# Altium project 100863_project.prjpcb
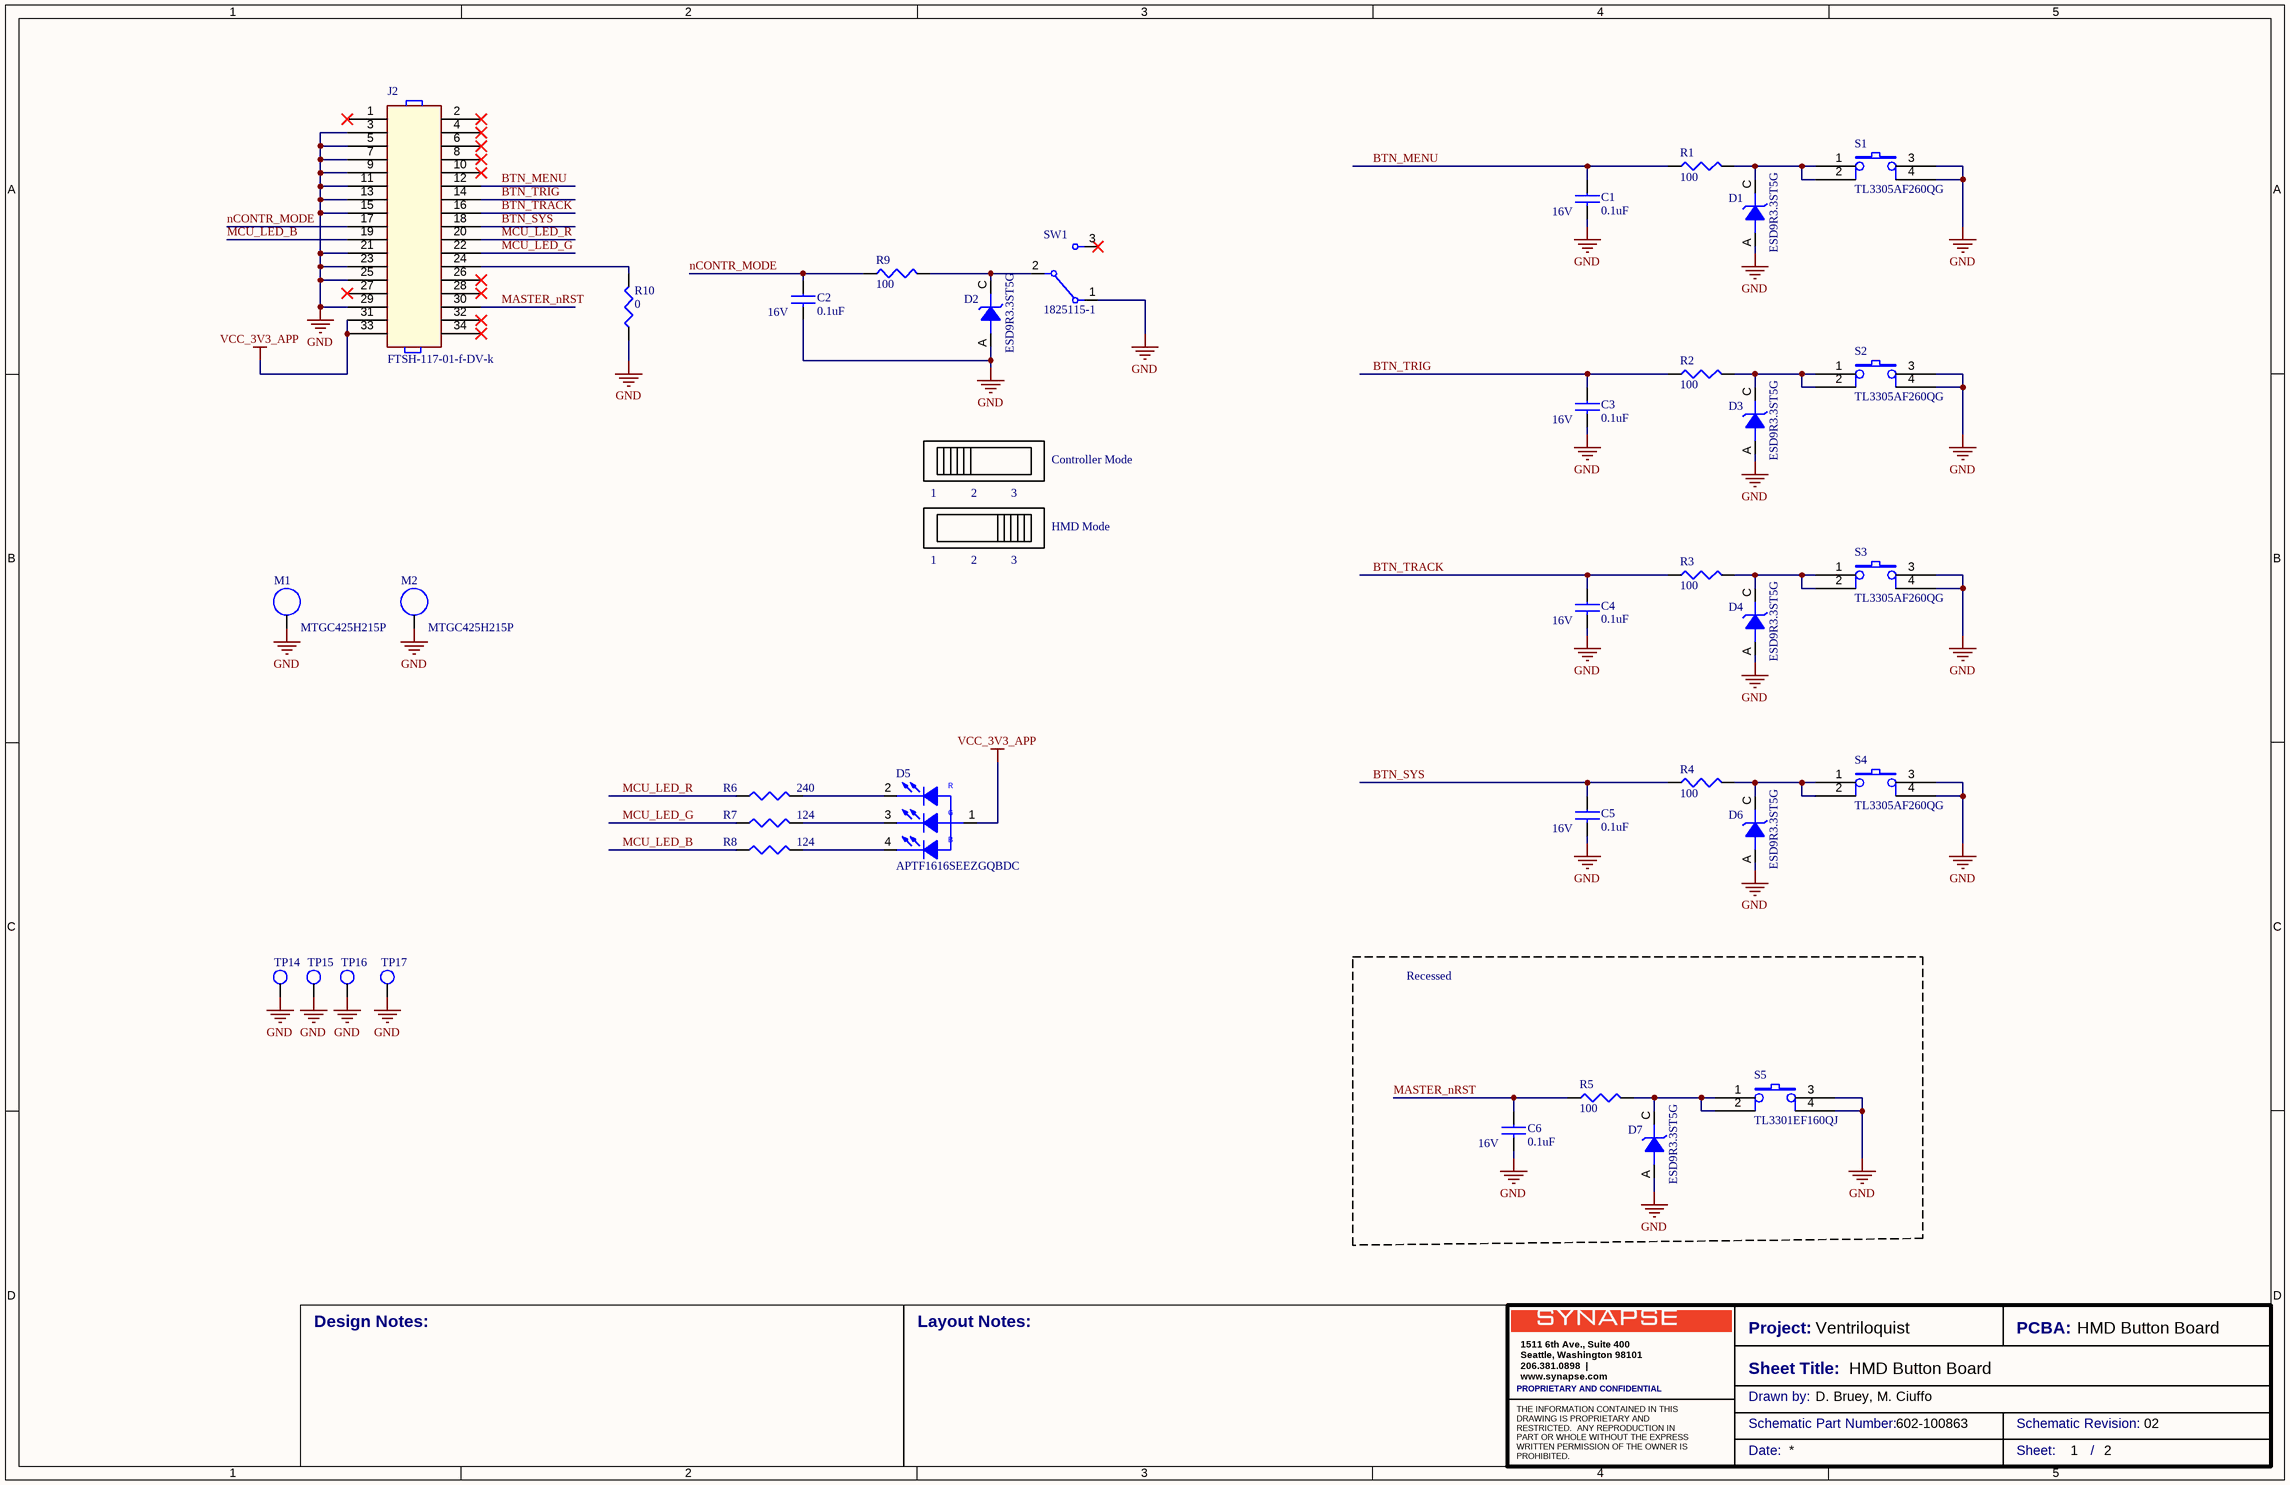
[diagram p0: HMD_Button.SchDoc]
Board_Name: HMD Button Board; Board_Number: 100863; PCB_Revision: 02; Project_Name: Ventriloquist; Sch_Revision: 02
2 sheets, 36 parts. Net scope: global (net labels, ports and power ports of the same name join across sheets).
Board file: 100863.PcbDoc
Sheets:
  HMD_Button.SchDoc
  Revision_Log.SchDoc

## Sheet HMD_Button.SchDoc: HMD Button Board
size 431 x 279 mm; DrawnBy: D. Bruey, M. Ciuffo; Organization: Synapse Product Development, LLC.; Address1: 1511 6th Ave., Suite 400; Address2: Seattle, Washington 98101; Address3: 206.381.0898; Address4: www.synapse.com; DocumentNumber: 1; SheetNumber: 1; SheetTotal: 2; PageSetup: Record=PageOptions|CenterHorizontal=True|CenterVertical=True|PrintScale=1.06|XCorrection=1.00|YCorrection=1.00|PrintKind=1|BorderSize=5000000|LeftOffset=0|BottomOffset=0|Orientation=2|PaperLength=4318|PaperWidth=2794|Scale=100|PaperSource=7|PrintQuality=200|MediaType=1|DitherType=10|PrintScaleMode=1|PaperKind=11x17|PaperIndex=3

### Parts
C1  0.1uF  Voltage: 16V  [0402-IPCsm_55]
C2  0.1uF  Voltage: 16V  [0402-IPCsm_55]
C3  0.1uF  Voltage: 16V  [0402-IPCsm_55]
C4  0.1uF  Voltage: 16V  [0402-IPCsm_55]
C5  0.1uF  Voltage: 16V  [0402-IPCsm_55]
C6  0.1uF  Voltage: 16V  [0402-IPCsm_55]
D1  ESD9R3.3ST5G  [sod923-40]
D2  ESD9R3.3ST5G  [sod923-40]
D3  ESD9R3.3ST5G  [sod923-40]
D4  ESD9R3.3ST5G  [sod923-40]
D5  APTF1616SEEZGQBDC  [led_RBG_1p6x1p6_sm]
D6  ESD9R3.3ST5G  [sod923-40]
D7  ESD9R3.3ST5G  [sod923-40]
J2  FTSH-117-01-f-DV-k  [FTSH-117-01-XXX-DV-K]
M1  MTGC425H215P  [MTGC425H215P]  (no BOM)
M2  MTGC425H215P  [MTGC425H215P]  (no BOM)
R1  100  [0402-IPCsm_40]
R2  100  [0402-IPCsm_40]
R3  100  [0402-IPCsm_40]
R4  100  [0402-IPCsm_40]
R5  100  [0402-IPCsm_40]
R6  240  [0402-IPCsm_40]
R7  124  [0402-IPCsm_40]
R8  124  [0402-IPCsm_40]
R9  100  [0402-IPCsm_40]
R10  0  [0402-IPCsm_40]
S1  TL3305AF260QG  [SW_TL3305_G]
S2  TL3305AF260QG  [SW_TL3305_G]
S3  TL3305AF260QG  [SW_TL3305_G]
S4  TL3305AF260QG  [SW_TL3305_G]
S5  TL3301EF160QJ  [SW_TL3301_J]
SW1  1825115-1  [SW_3_TE_1825115]
TP14  tp-1mm  [TP-S100_SMT]  (value not drawn)  (no BOM)
TP15  tp-1mm  [TP-S100_SMT]  (value not drawn)  (no BOM)
TP16  tp-1mm  [TP-S100_SMT]  (value not drawn)  (no BOM)
TP17  tp-1mm  [TP-S100_SMT]  (value not drawn)  (no BOM)

### Blocks framed on the sheet
Recessed: C6 D7 R5 S5

### Nets
GND: C1.2 C2.2 C3.2 C4.2 C5.2 C6.2 D1.A D2.A D3.A D4.A D6.A D7.A J2.3 J2.5 J2.7 J2.9 J2.11 J2.13 J2.15 J2.21 J2.23 J2.25 J2.29 M1.1 M2.1 R10.1 S1.3 S1.4 S2.3 S2.4 S3.3 S3.4 S4.3 S4.4 S5.3 S5.4 SW1.1 TP14.1(TP) TP15.1(TP) TP16.1(TP) TP17.1(TP)
VCC_3V3_APP: D5.1(ANODE) J2.31 J2.33
BTN_MENU: C1.1 J2.12 R1.1
BTN_SYS: C5.1 J2.18 R4.1
BTN_TRACK: C4.1 J2.16 R3.1
BTN_TRIG: C3.1 J2.14 R2.1
MASTER_nRST: C6.1 J2.30 R5.1
MCU_LED_B: J2.19 R8.1
MCU_LED_G: J2.22 R7.1
MCU_LED_R: J2.20 R6.1
nCONTR_MODE: C2.1 J2.17 R9.1
NetD1_C: D1.C R1.2 S1.1 S1.2
NetD2_C: D2.C R9.2 SW1.2
NetD3_C: D3.C R2.2 S2.1 S2.2
NetD4_C: D4.C R3.2 S3.1 S3.2
NetD5_2: D5.2(R) R6.2
NetD5_3: D5.3(G) R7.2
NetD5_4: D5.4(B) R8.2
NetD6_C: D6.C R4.2 S4.1 S4.2
NetD7_C: D7.C R5.2 S5.1 S5.2
NetJ2_24: J2.24 R10.2

Not connected (* = marked no-connect by the designer): J2 1* 2* 4* 6* 8* 10* 26* 27* 28* 32* 34*; SW1 3*

### Notes on the sheet
- 1
- 2
- 3
- Controller Mode
- HMD Mode
- Design Notes:
- Layout Notes:
- Project:
- Sheet Title:
- PCBA:
- PROPRIETARY AND CONFIDENTIAL
- Drawn by:
- Schematic Part Number:
- Schematic Revision:
- Date:
- Sheet:
- /

### Library data of the parts
C1-C6 = GRM155R71C104KA88D: CAP CER .1UF 16V X7R 0402; part_type: capacitor; id: 588; mfg: MURATA; dist: DIGIKEY; dist_pn: 490-3261-1-ND; source_package: C_0P1U_16V_X7R_0402; tolerance: 10%; TableName: viewAltiumCapacitors; mfg_pn: GRM155R71C104KA88D; type: X7R; height: 0.55MM; status: Unknown
D1-D4 D6 D7 = ESD9R3.3ST5G: TVS DIODE 3.3VWM 7.8VC SOD923; id: 1102; mfg: On Semiconductor; dist: Digikey; dist_pn: ESD9R3.3ST5GOSCT-ND; voltage: 3.3V; TableName: viewAltiumDiscretes; mfg_pn: ESD9R3.3ST5G; part_type: tvs; type: TVS; status: Unknown; height: 0.4mm
D5 = APTF1616SEEZGQBDC: LED RGB CLEAR 0606 SMD; id: 1228; mfg: Kingbright; dist: Digikey; dist_pn: 754-1500-2-ND; current: 25mA; TableName: viewAltiumDiscretes; mfg_pn: APTF1616SEEZGQBDC; part_type: LED; source_package: LED; height: .7mm; status: Unknown
J2 = FTSH-117-01-f-DV-k: 34 Positions Header, Shrouded Connector 0.050" (1.27mm) Surface Mount Gold; id: 1653; mfg: Samtec; dist: Digikey; dist_pn: SAM8912-ND; positions: 34; TableName: viewAltiumConnectors; mfg_pn: FTSH-117-01-F-DV-K; part_type: connector; height: 5.97mm; status: Unknown
M1 M2 = MTGC425H215P: MTG, 4.25mm PAD, 2.15mm Plated Hole; part_type: mounting; id: 1240; dist_pn: None; TableName: viewAltiumMisc; mfg_pn: MTGC425H215P; height: 0.05MM; status: Unknown
R1-R5 R9 = MCR01MZPJ101: RES 100 OHM 5% 0402 SMD; part_type: resistor; Tolerance: 5.00%; DIST: DIGIKEY; MFG: ROHM; DIST_PN: RHM100JCT-ND; id: 1182; source_package: R_ 100_5P_0402; TableName: viewAltiumResistors; Height: 0.4MM; MFG_PN: MCR01MZPJ101; status: Unknown
R6 = ERJ-2RKF2400X: RES 240 OHM 1/10W 1% 0402 SMD; part_type: resistor; DIST: Digikey; MFG: Panasonic; DIST_PN: P240LDKR-ND; Power: 0.1W; id: 2285; TableName: viewAltiumResistors; Tolerance: 1%; Height: 0.4mm; MFG_PN: ERJ-2RKF2400X; status: Good
R7 R8 = RC0402FR-07124RL: RES SMD 124 OHM 1% 1/16W 0402; part_type: resistor; Tolerance: 1.00%; DIST: DIGIKEY; MFG: Yageo; DIST_PN: 311-124LRCT-ND; Power: 0.0625W; id: 2370; TableName: viewAltiumResistors; Height: .4mm; MFG_PN: RC0402FR-07124RL; status: Unknown
R10 = ERJ-2GE0R00X: RES 0.0 OHM 1/10W JUMP 0402 SMD; part_type: resistor; Allegro_footprint: 0402-IPCsm_40,r-0402_16H; Tolerance: 5.00%; DIST: DIGIKEY; MFG: PANASONIC; DIST_PN: P0.0JDKR-ND; Power: 0.063W; id: 1129; symbol: MASTER_DISCRETE\RES; source_package: R_0_5P_0402; TableName: viewAltiumResistors; Height: 0.4MM; MFG_PN: ERJ-2GE0R00X; status: Unknown; SymbolPath: C:\EE-Vault\Libraries\Schematic\MASTER_DISCRETE\RES; OrCADSymbol: MASTER_DISCRETE\RES
S1-S4 = TL3305AF260QG: SWITCH TACTILE SPST-NO 50MA 12V; Part Number: TL3301AF260QG; Manufacturer: E-Switch; Dist PN: EG2527CT-ND; id: 1235; dist: Digikey; dist_pn: EG5353CT-ND; TableName: viewAltiumMisc; Distributor: Digikey; mfg_pn: TL3305AF260QG; mfg: E-Switch; part_type: switch; status: Unknown
S5 = TL3301EF160QJ: SWITCH TACTILE SPST-NO 0.05A 12V; Part Number: TL3301AF260QG; Manufacturer: E-Switch; Dist PN: EG2527CT-ND; id: 1237; dist: Digikey; dist_pn: TL3301EF160QJCT-ND; TableName: viewAltiumMisc; Distributor: Digikey; mfg_pn: TL3301EF160QJ; mfg: E-Switch; part_type: switch; status: Unknown
SW1 = 1825115-1: SWITCH SLIDE SPDT 250MA 125V; id: 1238; mfg: TE Connectivity; dist: Digikey; dist_pn: 450-1598-ND; TableName: viewAltiumMisc; mfg_pn: 1825115-1; part_type: switch; status: Unknown
TP14-TP17 = TP0042: TESTPOINT, 1MM SMD, Square pad, Round SM opening; part_type: test_point; mfg_pn: TP0042; mfg: NA; id: 888; TableName: viewAltiumMisc; dist: NA; dist_pn: NA; source_package: tp_smt; status: Unknown

## Sheet Revision_Log.SchDoc: Revision Log
size 431 x 279 mm; DrawnBy: D. Bruey, M. Ciuffo; Organization: Synapse Product Development, LLC.; Address1: 1511 6th Ave., Suite 400; Address2: Seattle, Washington 98101; Address3: 206.381.0898; Address4: www.synapse.com; DocumentNumber: 2; SheetNumber: 2; SheetTotal: 2; PageSetup: Record=PageOptions|CenterHorizontal=True|CenterVertical=True|PrintScale=1.06|XCorrection=1.00|YCorrection=1.00|PrintKind=1|BorderSize=5000000|LeftOffset=0|BottomOffset=0|Orientation=2|PaperLength=4318|PaperWidth=2794|Scale=100|PaperSource=7|PrintQuality=200|MediaType=1|DitherType=10|PrintScaleMode=1|PaperKind=11x17|PaperIndex=3
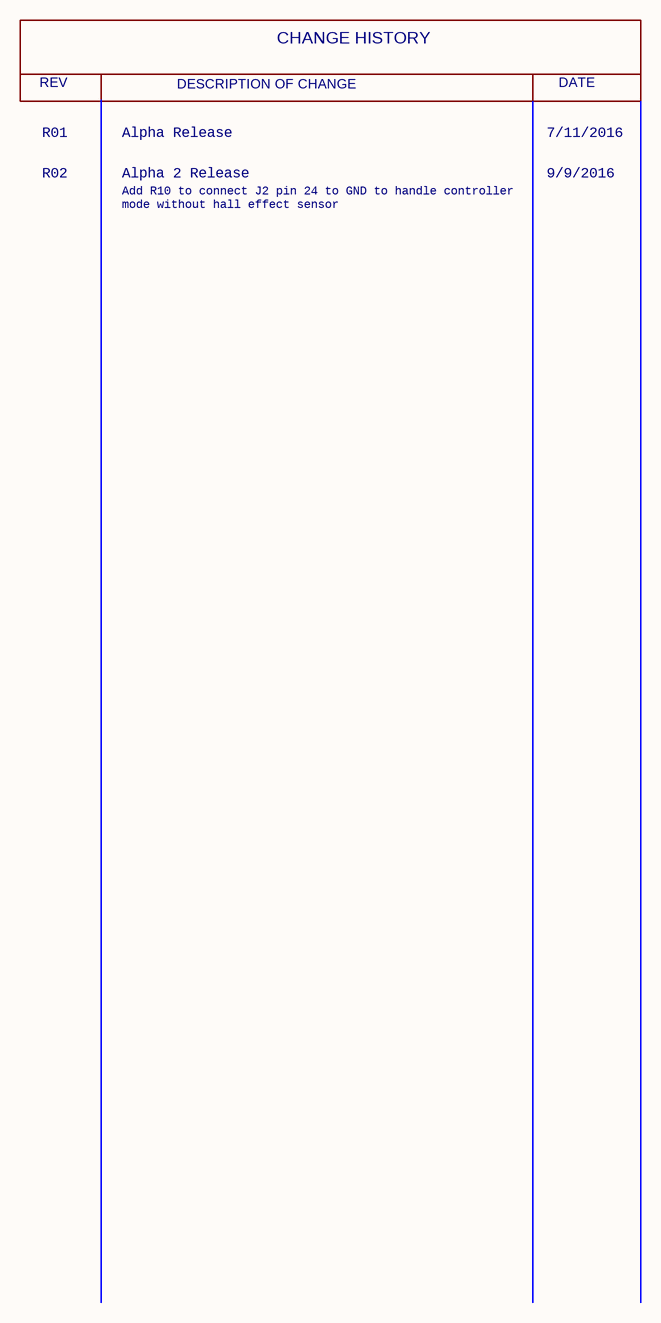
[diagram p1: Revision_Log.SchDoc]

### Notes on the sheet
- REV
- DESCRIPTION OF CHANGE
- CHANGE HISTORY
- DATE
- R01
- Alpha Release
- 7/11/2016
- R02
- Alpha 2 Release
- 9/9/2016
- Add R10 to connect J2 pin 24 to GND to handle controller mode without hall effect sensor
- Design Notes:
- Layout Notes:
- Project:
- Sheet Title:
- PCBA:
- PROPRIETARY AND CONFIDENTIAL
- Drawn by:
- Schematic Part Number:
- Schematic Revision:
- Date:
- Sheet:
- /

## Assembly variants
100863: all parts fitted